# Altium project TIMESTICK_2.1.3.PrjPcb (part 1 of 2)
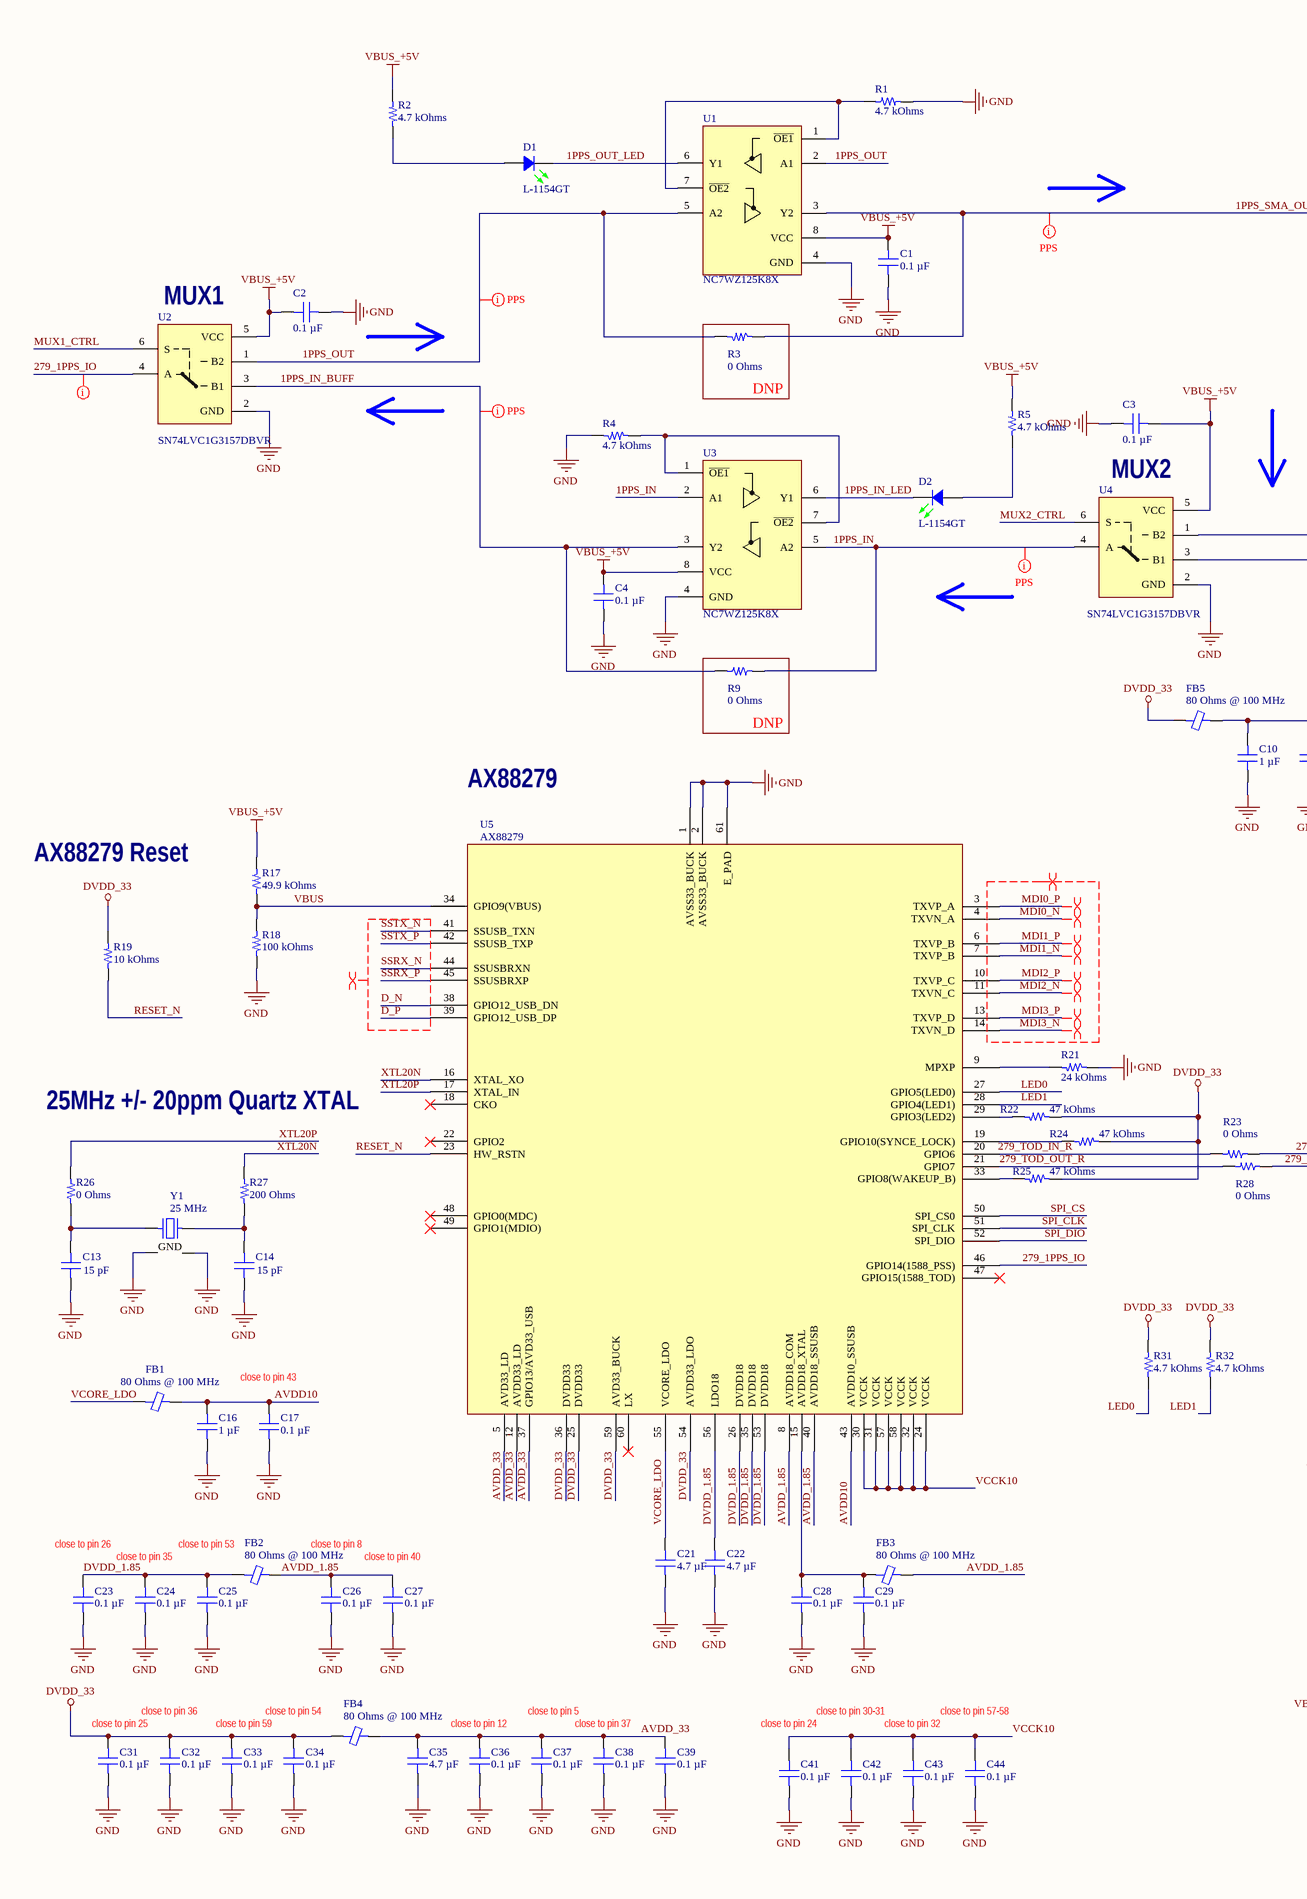
[diagram p0: MAIN.SchDoc, left]
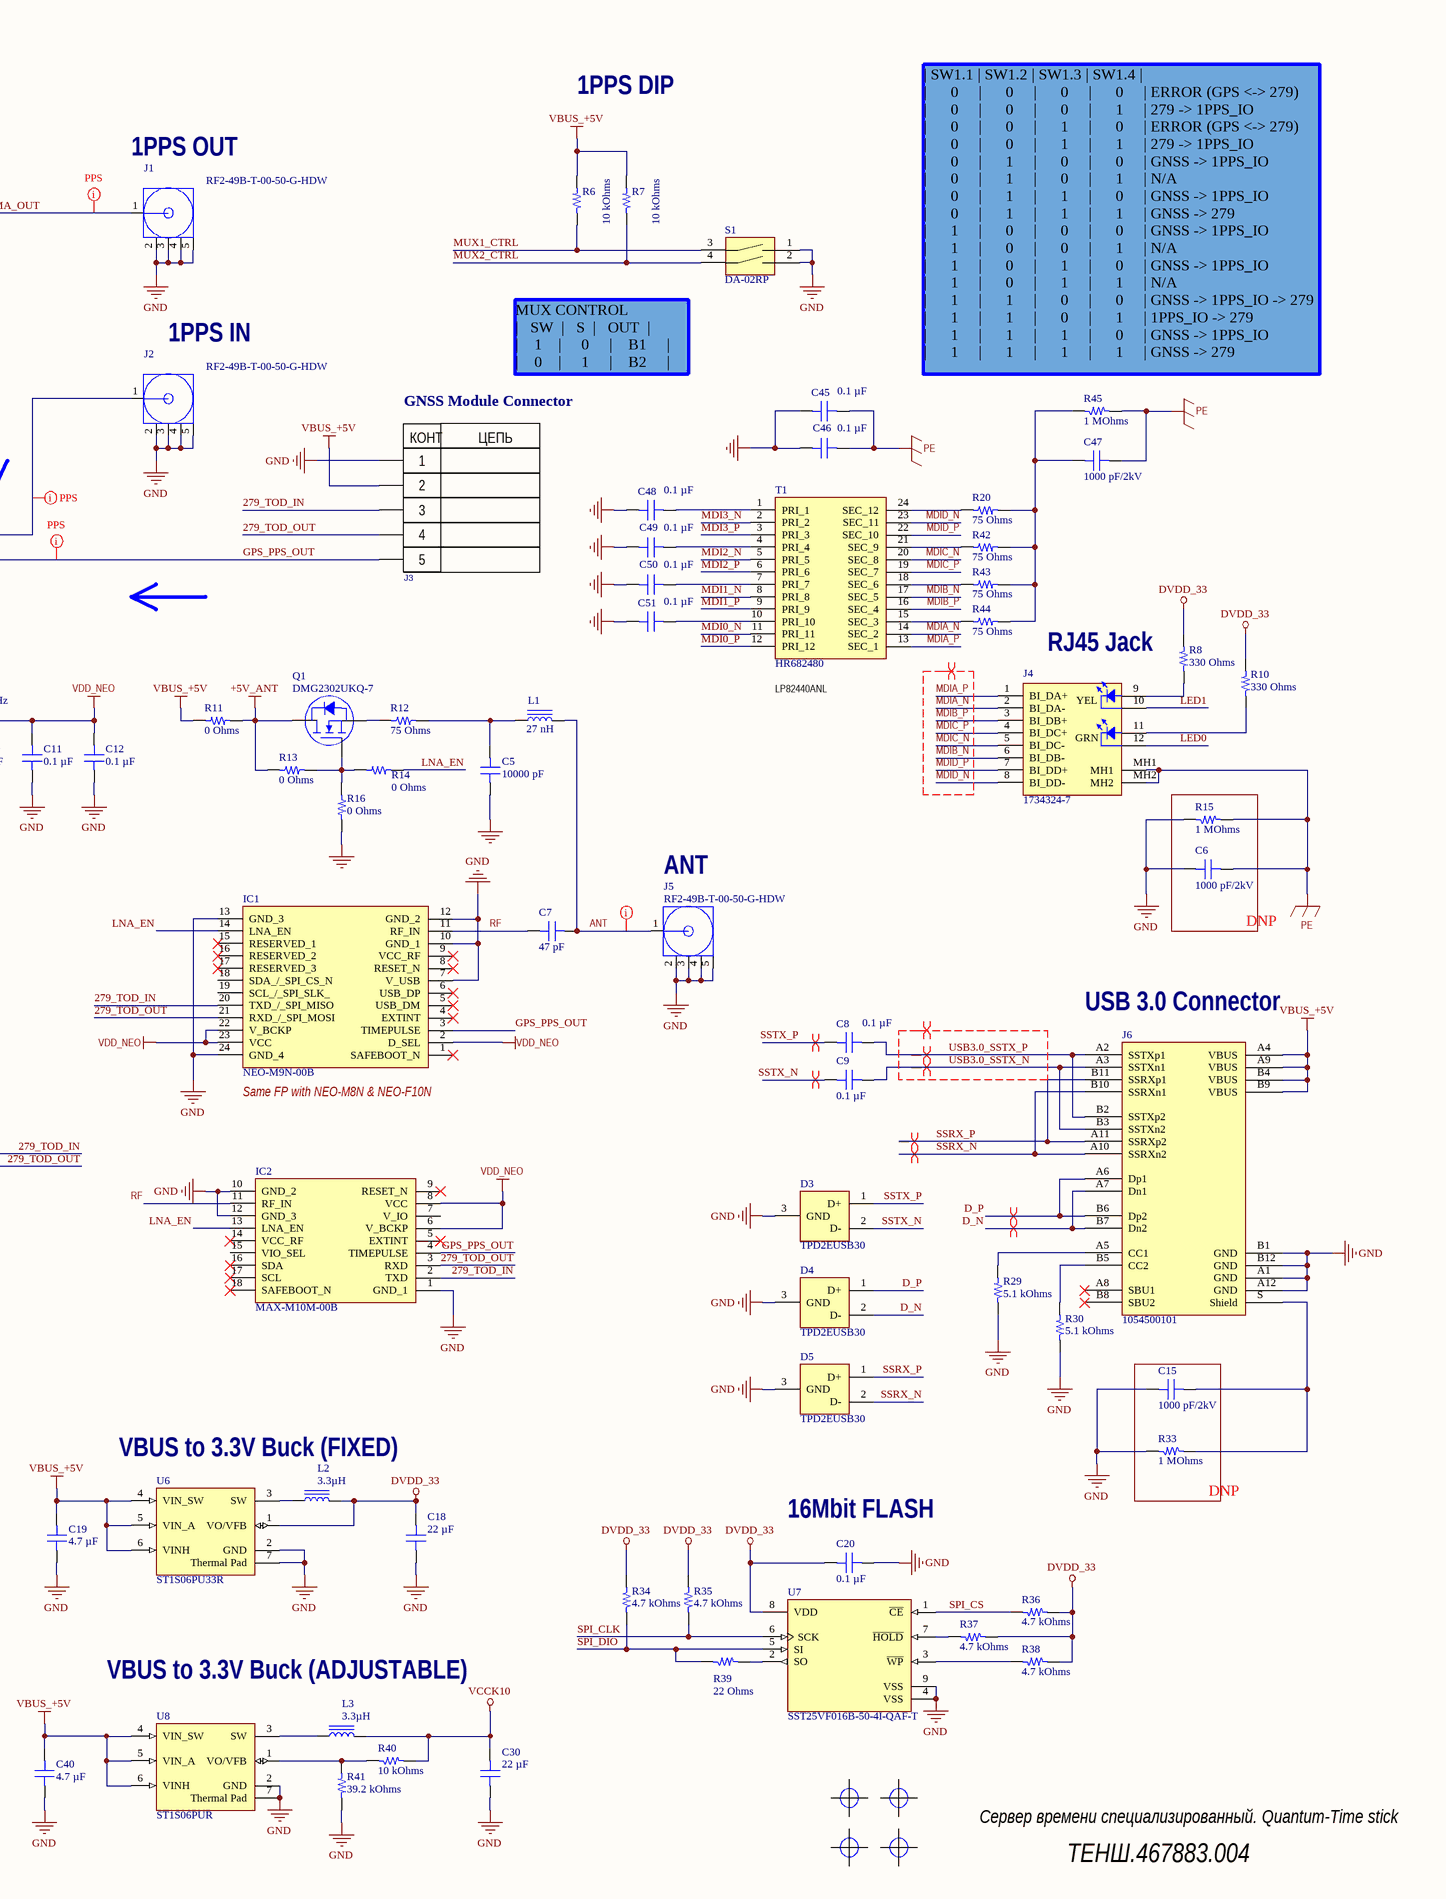
[diagram p1: MAIN.SchDoc, right]
revision: rev.1.3
1 sheet, 133 parts. Net scope: global (net labels, ports and power ports of the same name join across sheets).
Board file: TIMESTICK_2.1.PcbDoc

## Sheet MAIN.SchDoc
size A2; SheetNumber: 1; SheetTotal: 1

### Parts
C1  0.1 µF  [CAP 0402_1005]
C2  0.1 µF  [CAP 0402_1005]
C3  0.1 µF  [CAP 0402_1005]
C4  0.1 µF  [CAP 0402_1005]
C5  10000 pF  [CAP 0402_1005]
C6  1000 pF/2kV  [CAP 1206_3216 - 0.8MM]
C7  47 pF  [CAP 0402_1005]
C8  0.1 µF  [CAP 0402_1005]
C9  0.1 µF  [CAP 0402_1005]
C10  1 µF  [CAP 0402_1005]
C11  0.1 µF  [CAP 0402_1005]
C12  0.1 µF  [CAP 0402_1005]
C13  15 pF  [CAP 0402_1005]
C14  15 pF  [CAP 0402_1005]
C15  1000 pF/2kV  [CAP 1206_3216 - 0.8MM]
C16  1 µF  [CAP 0402_1005]
C17  0.1 µF  [CAP 0402_1005]
C18  22 µF  [CAP 0603_1608]
C19  4.7 µF  [CAP 0402_1005]
C20  0.1 µF  [CAP 0402_1005]
C21  4.7 µF  [CAP 0402_1005]
C22  4.7 µF  [CAP 0402_1005]
C23  0.1 µF  [CAP 0402_1005]
C24  0.1 µF  [CAP 0402_1005]
C25  0.1 µF  [CAP 0402_1005]
C26  0.1 µF  [CAP 0402_1005]
C27  0.1 µF  [CAP 0402_1005]
C28  0.1 µF  [CAP 0402_1005]
C29  0.1 µF  [CAP 0402_1005]
C30  22 µF  [CAP 0603_1608]
C31  0.1 µF  [CAP 0402_1005]
C32  0.1 µF  [CAP 0402_1005]
C33  0.1 µF  [CAP 0402_1005]
C34  0.1 µF  [CAP 0402_1005]
C35  4.7 µF  [CAP 0402_1005]
C36  0.1 µF  [CAP 0402_1005]
C37  0.1 µF  [CAP 0402_1005]
C38  0.1 µF  [CAP 0402_1005]
C39  0.1 µF  [CAP 0402_1005]
C40  4.7 µF  [CAP 0402_1005]
C41  0.1 µF  [CAP 0402_1005]
C42  0.1 µF  [CAP 0402_1005]
C43  0.1 µF  [CAP 0402_1005]
C44  0.1 µF  [CAP 0402_1005]
C45  0.1 µF  [CAP 0402_1005]
C46  0.1 µF  [CAP 0402_1005]
C47  1000 pF/2kV  [CAP 1206_3216 - 0.8MM]
C48  0.1 µF  [CAP 0402_1005]
C49  0.1 µF  [CAP 0402_1005]
C50  0.1 µF  [CAP 0402_1005]
C51  0.1 µF  [CAP 0402_1005]
D1  L-1154GT  [LED_3MM_GREEN]
D2  L-1154GT  [LED_3MM_GREEN]
D3  TPD2EUSB30  [SOT35P100X50-3N]
D4  TPD2EUSB30  [SOT35P100X50-3N]
D5  TPD2EUSB30  [SOT35P100X50-3N]
FB1  80 Ohms @ 100 MHz  [FER 0402_1005]
FB2  80 Ohms @ 100 MHz  [FER 0402_1005]
FB3  80 Ohms @ 100 MHz  [FER 0402_1005]
FB4  80 Ohms @ 100 MHz  [FER 0402_1005]
FB5  80 Ohms @ 100 MHz  [FER 0402_1005]
IC1  NEO-M9N-00B  [NEOM9N00B]
IC2  MAX-M10M-00B  [MAXM10M00B]
J1  RF2-49B-T-00-50-G-HDW  [RF249BT0050GHDW]
J2  RF2-49B-T-00-50-G-HDW  [RF249BT0050GHDW]
J3  PBS-5  [PBS-5]  (value not drawn)
J4  1734324-7  [17343247]
J5  RF2-49B-T-00-50-G-HDW  [RF249BT0050GHDW]
J6  1054500101  [Molex 1054500101]
L1  27 nH  [Murata LQG15 0402]
L2  3.3µH  [IND 1008_2520]
L3  3.3µH  [IND 1008_2520]
MNT1  MOUNT_HOLE  [MOUNT_3mm]  (value not drawn)  (no BOM)
MNT2  MOUNT_HOLE  [MOUNT_3mm]  (value not drawn)  (no BOM)
MNT3  MOUNT_HOLE  [MOUNT_3mm]  (value not drawn)  (no BOM)
MNT4  MOUNT_HOLE  [MOUNT_3mm]  (value not drawn)  (no BOM)
Q1  DMG2302UKQ-7  [DIODES SOT-23-3]
R1  4.7 kOhms  [YAGEO RES 0402_1005]
R2  4.7 kOhms  [YAGEO RES 0402_1005]
R3  0 Ohms  [YAGEO RES 0402_1005]
R4  4.7 kOhms  [YAGEO RES 0402_1005]
R5  4.7 kOhms  [YAGEO RES 0402_1005]
R6  10 kOhms  [YAGEO RES 0402_1005]
R7  10 kOhms  [YAGEO RES 0402_1005]
R8  330 Ohms  [YAGEO RES 0402_1005]
R9  0 Ohms  [YAGEO RES 0402_1005]
R10  330 Ohms  [YAGEO RES 0402_1005]
R11  0 Ohms  [YAGEO RES 0402_1005]
R12  75 Ohms  [YAGEO RES 0603_1608]
R13  0 Ohms  [YAGEO RES 0402_1005]
R14  0 Ohms  [YAGEO RES 0402_1005]
R15  1 MOhms  [YAGEO RES 0402_1005]
R16  0 Ohms  [YAGEO RES 0402_1005]
R17  49.9 kOhms  [YAGEO RES 0402_1005]
R18  100 kOhms  [YAGEO RES 0402_1005]
R19  10 kOhms  [YAGEO RES 0402_1005]
R20  75 Ohms  [YAGEO RES 0603_1608]
R21  24 kOhms  [YAGEO RES 0402_1005]
R22  47 kOhms  [YAGEO RES 0402_1005]
R23  0 Ohms  [YAGEO RES 0402_1005]
R24  47 kOhms  [YAGEO RES 0402_1005]
R25  47 kOhms  [YAGEO RES 0402_1005]
R26  0 Ohms  [YAGEO RES 0402_1005]
R27  200 Ohms  [YAGEO RES 0402_1005]
R28  0 Ohms  [YAGEO RES 0402_1005]
R29  5.1 kOhms  [YAGEO RES 0402_1005]
R30  5.1 kOhms  [YAGEO RES 0402_1005]
R31  4.7 kOhms  [YAGEO RES 0402_1005]
R32  4.7 kOhms  [YAGEO RES 0402_1005]
R33  1 MOhms  [YAGEO RES 0402_1005]
R34  4.7 kOhms  [YAGEO RES 0402_1005]
R35  4.7 kOhms  [YAGEO RES 0402_1005]
R36  4.7 kOhms  [YAGEO RES 0402_1005]
R37  4.7 kOhms  [YAGEO RES 0402_1005]
R38  4.7 kOhms  [YAGEO RES 0402_1005]
R39  22 Ohms  [YAGEO RES 0402_1005]
R40  10 kOhms  [YAGEO RES 0402_1005]
R41  39.2 kOhms  [YAGEO RES 0402_1005]
R42  75 Ohms  [YAGEO RES 0603_1608]
R43  75 Ohms  [YAGEO RES 0603_1608]
R44  75 Ohms  [YAGEO RES 0603_1608]
R45  1 MOhms  [YAGEO RES 0402_1005]
S1  DA-02RP  [DA02RP]
T1  HR682480  [SOP99P1016X432-24N]
U1  NC7WZ125K8X  [SOP50P310X90-8N]
U2  SN74LVC1G3157DBVR  [SOT95P280X145-6N]
U3  NC7WZ125K8X  [SOP50P310X90-8N]
U4  SN74LVC1G3157DBVR  [SOT95P280X145-6N]
U5  AX88279  [IC_AX88279]
U6  ST1S06PU33R  [DFN6D_L]
U7  SST25VF016B-50-4I-QAF-T  [FP-C04-452-MFG]
U8  ST1S06PUR  [DFN6D_M]
Y1  25 MHz  [NDK NX3225GA]

### Blocks framed on the sheet
DNP: R3
DNP: R9
DNP: C6 R15
DNP: C15 R33

### Nets
+5V_ANT: Q1.3(D) R11.1 R13.2
DVDD_33: C18.2 C20.2 C31.2 C32.2 C33.2 C34.2 FB4.1 FB5.1 L2.2 R8.2 R10.2 R19.2 R22.2 R24.2 R25.2 R31.1 R32.1 R34.1 R35.1 R36.1 R37.1 R38.1 U5.25(DVDD33) U5.36(DVDD33) U5.54(AVDD33_LDO) U5.59(AVD33_BUCK) U6.1(VO/VFB) U7.8(VDD)
GND: C1.1 C2.1 C3.1 C4.1 C5.1 C6.2 C10.1 C11.1 C12.1 C13.1 C14.1 C15.1 C16.1 C17.1 C18.1 C19.1 C20.1 C21.1 C22.1 C23.1 C24.1 C25.1 C26.1 C27.1 C28.1 C29.1 C30.1 C31.1 C32.1 C33.1 C34.1 C35.1 C36.1 C37.1 C38.1 C39.1 C40.1 C41.1 C42.1 C43.1 C44.1 C45.2 C46.2 C48.2 C49.2 C50.2 C51.2 D3.3(GND) D4.3(GND) D5.3(GND) IC1.7(V_USB) IC1.10(GND_1) IC1.12(GND_2) IC1.13(GND_3) IC1.24(GND_4) IC2.1(GND_1) IC2.10(GND_2) IC2.12(GND_3) J1.2 J1.3 J1.4 J1.5 J2.2 J2.3 J2.4 J2.5 J3.1 J5.2 J5.3 J5.4 J5.5 J6.A1(GND) J6.A12(GND) J6.B1(GND) J6.B12(GND) R1.2 R4.1 R15.2 R16.2 R18.1 R21.1 R29.2 R30.2 R33.1 R41.2 S1.1(NO_1) S1.2(NO_2) U1.4(GND) U2.2(GND) U3.4(GND) U4.2(GND) U5.1(AVSS33_BUCK) U5.2(AVSS33_BUCK) U5.61(E_PAD) U6.2(GND) U6.7(Thermal_Pad) U7.4(VSS) U7.9(VSS) U8.2(GND) U8.7(Thermal_Pad) Y1.2(GND) Y1.4(GND)
PE: C6.1 C45.1 C46.1 C47.1 J4.MH1 J4.MH2 R15.1 R45.1
VBUS_+5V: C1.2 C2.2 C3.2 C4.2 C19.2 C40.2 J3.2 J6.A4(VBUS) J6.A9(VBUS) J6.B4(VBUS) J6.B9(VBUS) R2.2 R5.2 R6.2 R7.2 R11.2 R17.2 U1.8(VCC) U2.5(VCC) U3.8(VCC) U4.5(VCC) U6.4(VIN_SW) U6.5(VIN_A) U6.6(VINH) U8.4(VIN_SW) U8.5(VIN_A) U8.6(VINH)
VCCK10: C30.2 C41.2 C42.2 C43.2 C44.2 L3.2 R40.1 U5.24(VCCK) U5.30(VCCK) U5.31(VCCK) U5.32(VCCK) U5.57(VCCK) U5.58(VCCK)
VDD_NEO: C10.2 C11.2 C12.2 FB5.2 IC1.2(D_SEL) IC1.22(V_BCKP) IC1.23(VCC) IC2.6(V_BCKP) IC2.8(VCC)
1PPS_IN: R9.1 U3.2(A1) U3.5(A2) U4.4(A)
1PPS_IN_BUFF: R9.2 U2.3(B1) U3.3(Y2)
1PPS_IN_LED: D2.C U3.6(Y1)
1PPS_OUT: R3.2 U1.2(A1) U1.5(A2) U2.1(B2)
1PPS_OUT_LED: D1.C U1.6(Y1)
1PPS_SMA_OUT: J1.1 R3.1 U1.3(Y2)
279_1PPS_IO: U2.4(A) U5.46(GPIO14(1588_PSS))
279_TOD_IN: IC1.20(TXD_/_SPI_MISO) IC2.2(TXD) J3.3 R23.1
279_TOD_IN_R: R23.2 U5.20(GPIO6)
279_TOD_OUT: IC1.21(RXD_/_SPI_MOSI) IC2.3(RXD) J3.4 R28.1
279_TOD_OUT_R: R28.2 U5.21(GPIO7)
ANT: C7.1 J5.1 L1.2
AVDD10: C16.2 C17.2 FB1.2 U5.43(AVDD10_SSUSB)
AVDD_1.85: C26.2 C27.2 FB2.2 FB3.2 U5.8(AVDD18_COM) U5.40(AVDD18_SSUSB)
AVDD_33: C35.2 C36.2 C37.2 C38.2 C39.2 FB4.2 U5.5(AVD33_LD) U5.12(AVDD33_LD) U5.37(GPIO13/AVD33_USB)
D_N: D4.2(D-) J6.A7(Dn1) J6.B7(Dn2) U5.38(GPIO12_USB_DN)
D_P: D4.1(D+) J6.A6(Dp1) J6.B6(Dp2) U5.39(GPIO12_USB_DP)
DVDD_1.85: C22.2 C23.2 C24.2 C25.2 FB2.1 U5.26(DVDD18) U5.35(DVDD18) U5.53(DVDD18) U5.56(LDO18)
GPS_PPS_OUT: IC1.3(TIMEPULSE) IC2.4(TIMEPULSE) J3.5 U4.3(B1)
LED0: J4.12(K_GR) R31.2 U5.27(GPIO5(LED0))
LED1: J4.10(K_YEL) R32.2 U5.28(GPIO4(LED1))
LNA_EN: IC1.14(LNA_EN) IC2.13(LNA_EN) R14.1
MDI0_N: T1.11(PRI_11) U5.4(TXVN_A)
MDI0_P: T1.12(PRI_12) U5.3(TXVP_A)
MDI1_N: T1.8(PRI_8) U5.7(TXVP_B)
MDI1_P: T1.9(PRI_9) U5.6(TXVP_B)
MDI2_N: T1.5(PRI_5) U5.11(TXVN_C)
MDI2_P: T1.6(PRI_6) U5.10(TXVP_C)
MDI3_N: T1.2(PRI_2) U5.14(TXVN_D)
MDI3_P: T1.3(PRI_3) U5.13(TXVP_D)
MDIA_N: J4.2(BI_DA-) T1.14(SEC_2)
MDIA_P: J4.1(BI_DA+) T1.13(SEC_1)
MDIB_N: J4.6(BI_DB-) T1.17(SEC_5)
MDIB_P: J4.3(BI_DB+) T1.16(SEC_4)
MDIC_N: J4.5(BI_DC-) T1.20(SEC_8)
MDIC_P: J4.4(BI_DC+) T1.19(SEC_7)
MDID_N: J4.8(BI_DD-) T1.23(SEC_11)
MDID_P: J4.7(BI_DD+) T1.22(SEC_10)
MUX1_CTRL: R6.1 S1.3(COM_1) U2.6(S)
MUX2_CTRL: R7.1 S1.4(COM_2) U4.6(S)
RESET_N: R19.1 U5.23(HW_RSTN)
RF: C7.2 IC1.11(RF_IN) IC2.11(RF_IN)
SPI_CLK: R35.2 U5.51(SPI_CLK) U7.6(SCK)
SPI_CS: R36.2 U5.50(SPI_CS0) U7.1(~{CE})
SPI_DIO: R34.2 R39.2 U5.52(SPI_DIO) U7.5(SI)
SSRX_N: D5.2(D-) J6.A10(SSRXn2) J6.B10(SSRXn1) U5.44(SSUSBRXN)
SSRX_P: D5.1(D+) J6.A11(SSRXp2) J6.B11(SSRXp1) U5.45(SSUSBRXP)
SSTX_N: C9.2 D3.2(D-) U5.41(SSUSB_TXN)
SSTX_P: C8.2 D3.1(D+) U5.42(SSUSB_TXP)
USB3.0_SSTX_N: C9.1 J6.A3(SSTXn1) J6.B3(SSTXn2)
USB3.0_SSTX_P: C8.1 J6.A2(SSTXp1) J6.B2(SSTXp2)
VBUS: R17.1 R18.2 U5.34(GPIO9(VBUS))
VCORE_LDO: C21.2 FB1.1 U5.55(VCORE_LDO)
XTL20N: R27.2 U5.16(XTAL_XO)
XTL20P: R26.2 U5.17(XTAL_IN)
NetC5_2: C5.2 L1.1 R12.2
NetC13_2: C13.2 R26.1 Y1.1
NetC14_2: C14.2 R27.1 Y1.3
NetC15_2: C15.2 J6.S(Shield) R33.2
NetC28_2: C28.2 C29.2 FB3.1 U5.15(AVDD18_XTAL)
NetC47_2: C47.2 R20.2 R42.2 R43.2 R44.2 R45.2
NetC48_1: C48.1 T1.1(PRI_1)
NetC49_1: C49.1 T1.4(PRI_4)
NetC50_1: C50.1 T1.7(PRI_7)
NetC51_1: C51.1 T1.10(PRI_10)
NetD1_A: D1.A R2.1
NetD2_A: D2.A R5.1
NetJ2_1: J2.1 U4.1(B2)
NetJ4_9: J4.9(A_YEL) R8.1
NetJ4_11: J4.11(A_GR) R10.1
NetJ6_A5: J6.A5(CC1) R29.1
NetJ6_B5: J6.B5(CC2) R30.1
NetL2_1: L2.1 U6.3(SW)
NetL3_1: L3.1 U8.3(SW)
NetQ1_1: Q1.1(G) R13.1 R14.2 R16.1
NetQ1_2: Q1.2(S) R12.1
NetR1_1: R1.1 U1.1(~{OE1}) U1.7(~{OE2})
NetR4_2: R4.2 U3.1(~{OE1}) U3.7(~{OE2})
NetR20_1: R20.1 T1.24(SEC_12)
NetR21_2: R21.2 U5.9(MPXP)
NetR22_1: R22.1 U5.29(GPIO3(LED2))
NetR24_1: R24.1 U5.19(GPIO10(SYNCE_LOCK))
NetR25_1: R25.1 U5.33(GPIO8(WAKEUP_B))
NetR37_2: R37.2 U7.7(~{HOLD})
NetR38_2: R38.2 U7.3(~{WP})
NetR39_1: R39.1 U7.2(SO)
NetR40_2: R40.2 R41.1 U8.1(VO/VFB)
NetR42_1: R42.1 T1.21(SEC_9)
NetR43_1: R43.1 T1.18(SEC_6)
NetR44_1: R44.1 T1.15(SEC_3)

Not connected (* = marked no-connect by the designer): IC1 1(SAFEBOOT_N)* 4(EXTINT)* 5(USB_DM)* 6(USB_DP)* 8(RESET_N)* 9(VCC_RF)* 15(RESERVED_1)* 16(RESERVED_2)* 17(RESERVED_3)* 18(SDA_/_SPI_CS_N) 19(SCL_/_SPI_SLK_); IC2 5(EXTINT)* 7(V_IO) 9(RESET_N)* 14(VCC_RF)* 15(VIO_SEL) 16(SDA)* 17(SCL)* 18(SAFEBOOT_N)*; J6 A8(SBU1)* B8(SBU2)*; U5 18(CKO)* 22(GPIO2)* 47(GPIO15(1588_TOD))* 48(GPIO0(MDC))* 49(GPIO1(MDIO))* 60(LX)*

### Layout directives
differential pair; differential pair class MDI: MDI0_N, MDI0_P, MDI1_N, MDI1_P, MDI2_N, MDI2_P, MDI3_N, MDI3_P
differential pair; differential pair class USB; differential pair class *: D_N
differential pair; differential pair class USB: D_P, SSRX_N, SSRX_P, SSTX_N, SSTX_P, USB3.0_SSTX_N, USB3.0_SSTX_P
net class PPS_50: 1PPS_IN, 1PPS_IN_BUFF, 1PPS_OUT, 1PPS_SMA_OUT, 279_1PPS_IO, ANT, GPS_PPS_OUT, NetJ2_1
differential pair; differential pair class D100; net class MDI: MDI0_N, MDI0_P, MDI1_N, MDI1_P, MDI2_N, MDI2_P, MDI3_N, MDI3_P, MDIA_N, MDIA_P, MDIB_N, MDIB_P, MDIC_N, MDIC_P, MDID_N, MDID_P
differential pair; differential pair class D90; net class USB: D_N, D_P, SSRX_N, SSRX_P, SSTX_N, SSTX_P, USB3.0_SSTX_N, USB3.0_SSTX_P

### Notes on the sheet
- 1PPS DIP
- 1PPS OUT
- (near U2) MUX1
- 1PPS IN
- GNSS Module Connector
- MUX CONTROL
  |   SW  |   S  |   OUT  |
  |    1    |     0     |    B1     |
  |    0    |     1     |    B2     |
- (near R45) | SW1.1 | SW1.2 | SW1.3 | SW1.4 |
  |      0     |      0     |      0     |      0     | ERROR (GPS <-> 279)
  |      0     |      0     |      0     |      1     | 279 -> 1PPS_IO
  |      0     |      0     |      1     |      0     | ERROR (GPS <-> 279)
  |      0     |      0     |      1     |      1     | 279 -> 1PPS_IO
  |      0     |      1     |      0     |      0     | GNSS -> 1PPS_IO
  |      0     |      1     |      0     |      1     | N/A
  |      0     |      1     |      1     |      0     | GNSS -> 1PPS_IO
  |      0     |      1     |      1     |      1     | GNSS -> 279
  |      1     |      0     |      0     |      0     | GNSS -> 1PPS_IO
  |      1     |      0     |      0     |      1     | N/A
  |      1     |      0     |      1     |      0     | GNSS -> 1PPS_IO
  |      1     |      0     |      1     |      1     | N/A
  |      1     |      1     |      0     |      0     | GNSS -> 1PPS_IO -> 279
  |      1     |      1     |      0     |      1     | 1PPS_IO -> 279
  |      1     |      1     |      1     |      0     | GNSS -> 1PPS_IO
  |      1     |      1     |      1     |      1     | GNSS -> 279
- MUX2
- (near R8) RJ45 Jack
- (near T1) LP82440ANL
- AX88279
- AX88279 Reset
- ANT
- (near J6) USB 3.0 Connector
- (near IC1) Same FP with NEO-M8N & NEO-F10N
- 25MHz +/- 20ppm Quartz XTAL
- close to pin 43
- VBUS to 3.3V Buck (FIXED)
- (near C20) 16Mbit FLASH
- close to pin 26
- close to pin 35
- close to pin 53
- close to pin 8
- close to pin 40
- close to pin 36
- close to pin 54
- close to pin 5
- close to pin 30-31
- close to pin 57-58
- VBUS to 3.3V Buck (ADJUSTABLE)
- close to pin 25
- close to pin 59
- close to pin 12
- close to pin 37
- close to pin 24
- close to pin 32
- Сервер времени специализированный. Quantum-Time stick
- ТЕНШ.467883.004
- (in symbol 1734324-7) YEL; GRN
- (in symbol PBS-5) КОНТ; ЦЕПЬ